# Altium project 震动.PrjPCB
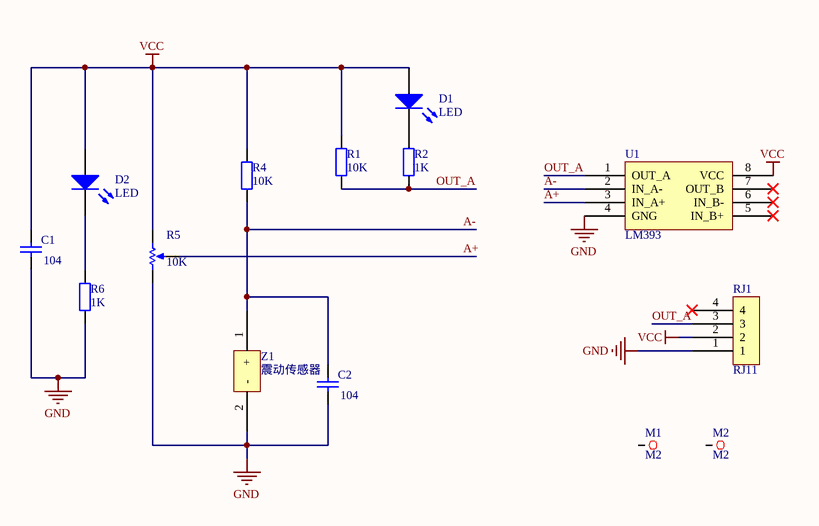
[diagram p0: 震动.SchDoc]
1 sheet, 14 parts. Net scope: global (net labels, ports and power ports of the same name join across sheets).
Board file: 震动.PcbDoc

## Sheet 震动.SchDoc
size A4

### Parts
C1  value 104  [0603_C]  (hidden comment: Cap)
C2  value 104  [0603_C]  (hidden comment: Cap)
D1  LED  [0805]
D2  LED  [0805]
M1  M2  [M2]
M2  M2  [M2]
R1  value 10K  [0603_R]  (hidden comment: Res2)
R2  value 1K  [0603_R]  (hidden comment: Res2)
R4  value 10K  [0603_R]  (hidden comment: Res2)
R5  value 10K  [电位器]  (hidden comment: RPot)
R6  value 1K  [0603_R]  (hidden comment: Res2)
RJ1  RJ11  [RJ11]
U1  LM393  [SO-8]
Z1  震动传感器  [震动传感器]

### Nets
GND: C1.1 C2.1 R5.1(TOP) R6.1 RJ1.1 U1.4(GNG) Z1.2(-)
VCC: C1.2 D1.1(A) D2.1(A) R1.2 R4.2 R5.2(BOT) RJ1.2 U1.8(VCC)
A+: R5.3(TAP) U1.3(IN_A+)
A-: C2.2 R4.1 U1.2(IN_A-) Z1.1(+)
OUT_A: R1.1 R2.1 RJ1.3 U1.1(OUT_A)
NetD1_2: D1.2(K) R2.2
NetD2_2: D2.2(K) R6.2

Not connected (* = marked no-connect by the designer): M1 0; M2 0; RJ1 4*; U1 5(IN_B+)* 6(IN_B-)* 7(OUT_B)*

### Library data of the parts
C1 C2 = Cap: Capacitor; Published: 8-Jun-2000; LatestRevisionDate: 17-Jul-2002; LatestRevisionNote: Re-released for DXP Platform.; PackageReference: RAD-0.3; Publisher: Altium Limited
D1 D2 = LED1: Typical RED GaAs LED; Published: 8-Jun-2000; LatestRevisionDate: 08-Jul-2005; LatestRevisionNote: Mech Layer 1 removed.; PackageReference: LED-1; Publisher: Altium Limited
M1 M2 = M3
R1 R2 R4 R6 = Res2: Resistor; Published: 8-Jun-2000; LatestRevisionDate: 17-Jul-2002; LatestRevisionNote: Re-released for DXP Platform.; PackageReference: AXIAL-0.4; Publisher: Altium Limited
R5 = RPot: Potentiometer; Sim Note: Enter the Resistance value and the set point into parameter fields.; Set Position: 0.5; Published: 8-Jun-2000; LatestRevisionDate: 17-Jul-2002; LatestRevisionNote: Re-released for DXP Platform.; PackageReference: VR5; Publisher: Altium Limited